# Altium schematic sheet LEDs.SchDoc
size A4; Author: Author; CompanyName: AGH Racing; DocumentNumber: 3; Revision: 2.1; SheetNumber: 3; SheetTotal: 11; CarNumber: 5; ProjectName: Project Name
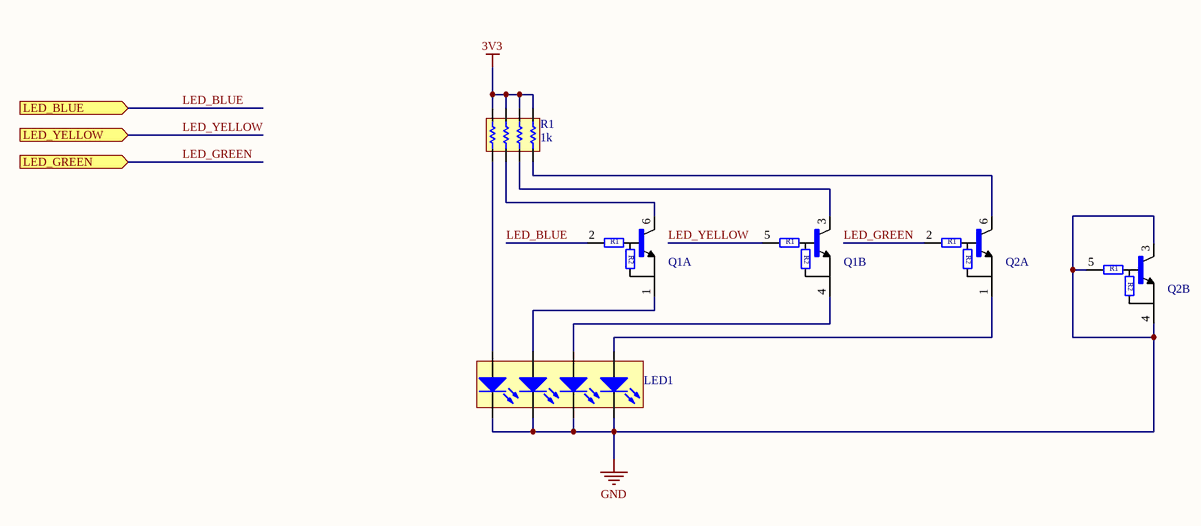
[diagram p0: LEDs.SchDoc]

## Parts
LED1  LED 4x  [MENTOR 1296.2022]  (value not drawn)
Q1  NPN BRT BCR116  [SOT363_IPC_MD]  (value not drawn)  (parts A,B of 2)
Q2  NPN BRT BCR116  [SOT363_IPC_MD]  (value not drawn)  (parts A,B of 2)
R1  value 1k  [RES_ARR_1206_IPC_LD]  (hidden comment: Res)

## Ports
LED_BLUE (in), LED_GREEN (in), LED_YELLOW (in)

## Nets
3V3: R1.1 R1.2 R1.3 R1.4
GND: LED1.2(K1) LED1.4(K2) LED1.6(K3) LED1.8(K4) Q2.3(C2) Q2.4(E2) Q2.5(B2)
LED_BLUE: Q1.2(B1) ; port LED_BLUE
LED_GREEN: Q2.2(B1) ; port LED_GREEN
LED_YELLOW: Q1.5(B2) ; port LED_YELLOW
NetLED1_1: LED1.1(A1) R1.8
NetLED1_3: LED1.3(A2) Q1.1(E1)
NetLED1_5: LED1.5(A3) Q1.4(E2)
NetLED1_7: LED1.7(A4) Q2.1(E1)
NetQ1_3: Q1.3(C2) R1.6
NetQ1_6: Q1.6(C1) R1.7
NetQ2_6: Q2.6(C1) R1.5

## Notes on the sheet
- Confidential / Not for distribution !
- Project name:
- Document name:
- Sheet:
- Car No.
- of
- Designer Name:
- Date/Time:
- Revision:
- (in symbol BCR116, part A) R1; R2
- (in symbol BCR116, part B) R1; R2

## Library data of the parts
LED1 = LED 4x: Manufacturer: Lucky Light; MPN: LL-S194PUAC-2A; Supplier: TME; SPN: LL-S194PUAC-2A
Q1 Q2 = BCR116: NPN Transistors pair with built-in bias resistor, R1 = 4k7, R2 = 47k
R1 = Res Array: Array Chip Resistors